# EAGLE design master (EAGLE 7.7.0)
Master Board Operation "Valhalla" CLASSIFIED: SECRET, NEED-TO-KNOW-ONLY This is the master board, it includes the master MCU and the RS-422 transceiver. One Ethernet NIC and one CanBUS NIC can be connected to this board to give a master assembly. The transceiver(r) are bus powered while the master MCU and remaining electronics are locally powered.
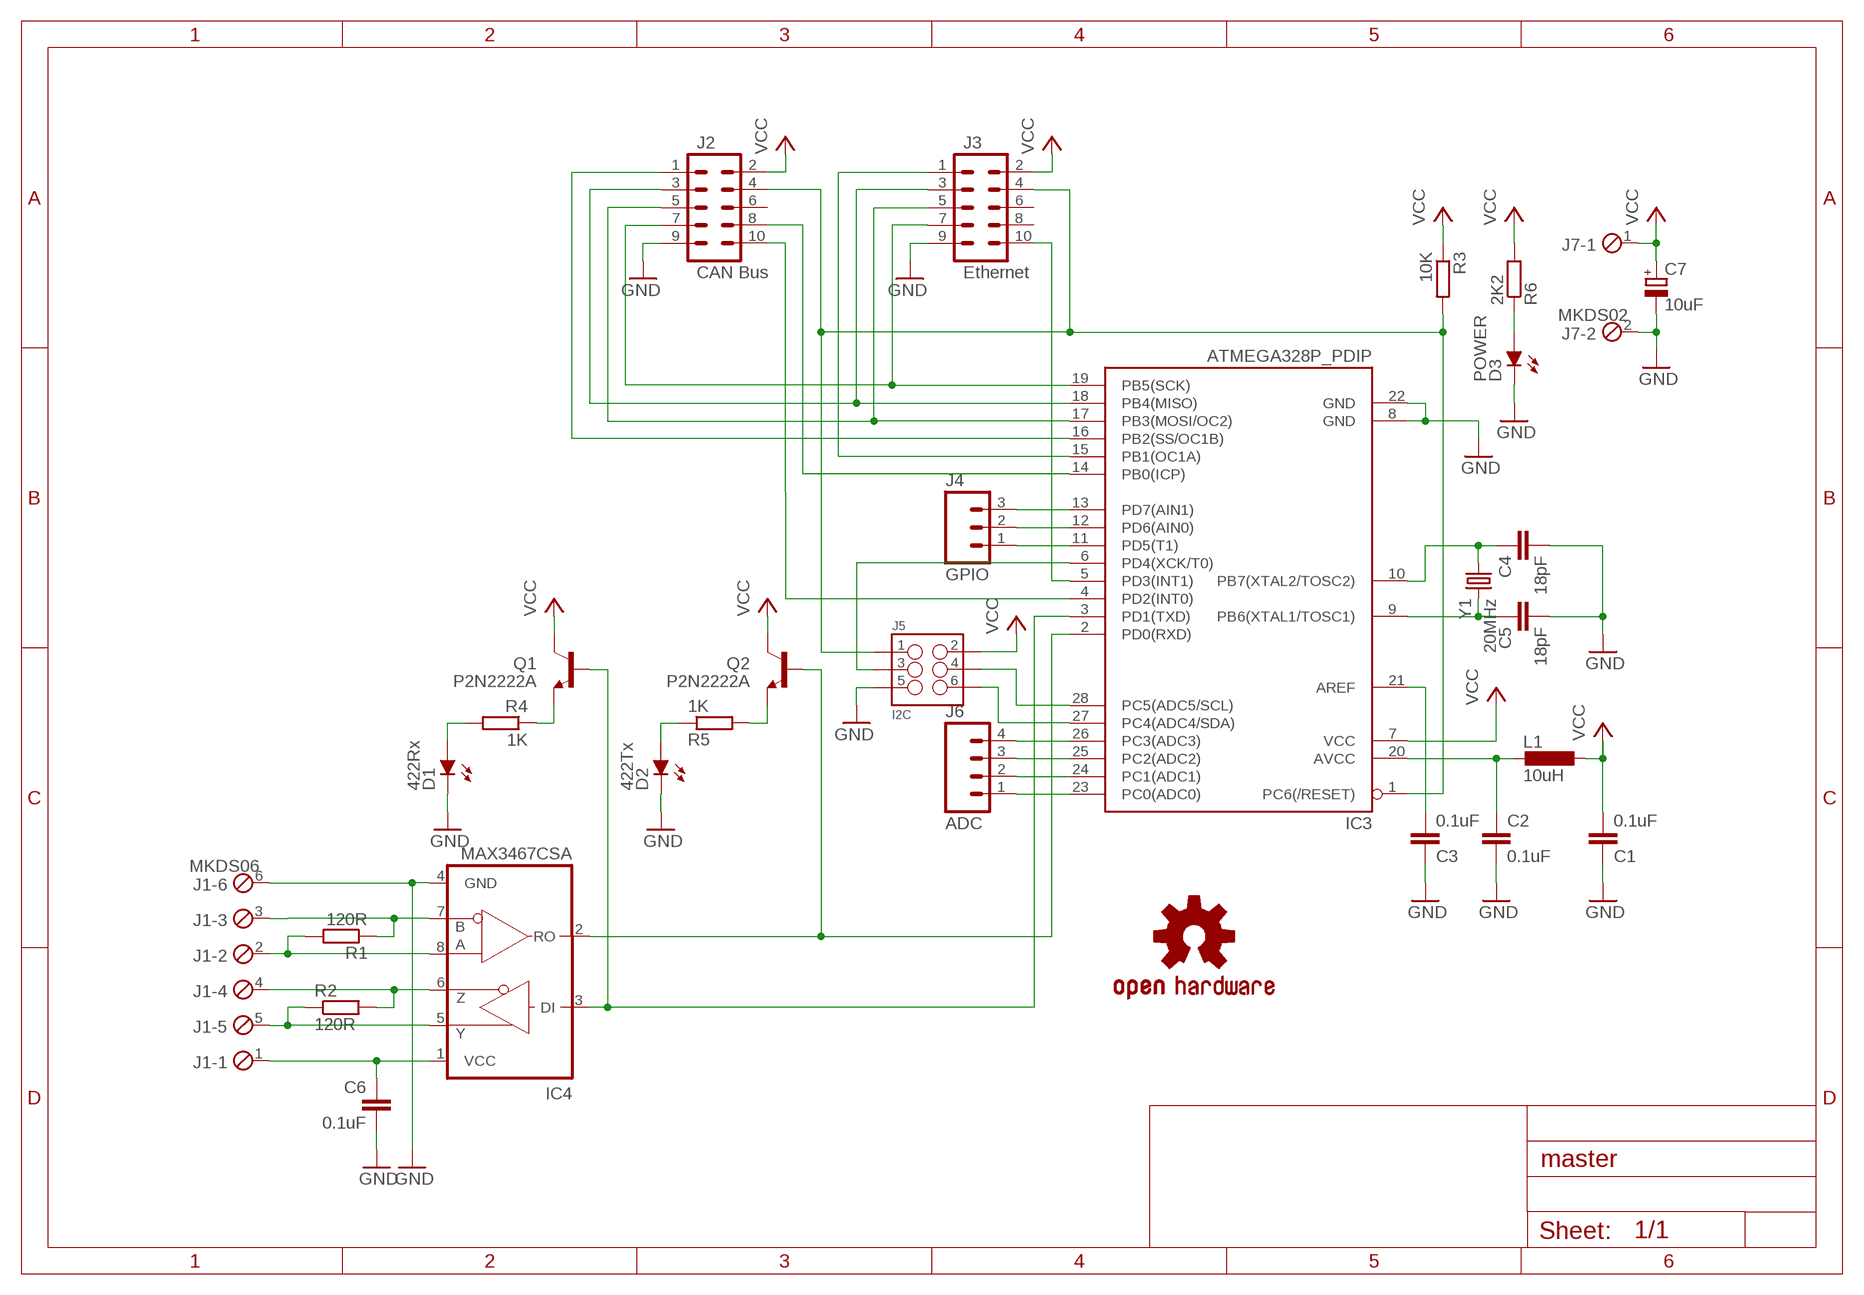
[diagram p0: schematic, sheet 1]

## Parts
C1  0.1uF  C-EU050-025X075  [C050-025X075]
C2  0.1uF  C-EU050-025X075  [C050-025X075]
C3  0.1uF  C-EU050-025X075  [C050-025X075]
C4  18pF  C-EU050-024X044  [C050-024X044]
C5  18pF  C-EU050-024X044  [C050-024X044]
C6  0.1uF  C-EU050-025X075  [C050-025X075]
C7  10uF  CPOL-EUE2.5-6  [E2,5-6]
D1  422Rx  LED3MM  [LED3MM]
D2  422Tx  LED3MM  [LED3MM]
D3  POWER  LED3MM  [LED3MM]
IC3  ATMEGA328P_PDIP  [DIL28-3]
IC4  MAX3467CSA  [DIL08]
J1  MKDS06  [MKDS06]
J2  CAN Bus  M05X2SHD  [2X5-SHROUDED]
J3  Ethernet  M05X2SHD  [2X5-SHROUDED]
J4  GPIO  M03PTH  [1X03]
J5  I2C  M03X2SHROUD  [2X3-SHROUDED]
J6  ADC  M04PTH  [1X04]
J7  MKDS02  [MKDS02]
L1  10uH  L-EU0207/5V  [0207/5V]
LOGO1  OSHW-LOGOM  [OSHW-LOGO-M]
Q1  P2N2222A  [TO92]
Q2  P2N2222A  [TO92]
R1  120R  R-EU_0207/5V  [0207/5V]
R2  120R  R-EU_0207/5V  [0207/5V]
R3  10K  R-EU_0207/5V  [0207/5V]
R4  1K  R-EU_0207/5V  [0207/5V]
R5  1K  R-EU_0207/5V  [0207/5V]
R6  2K2  R-EU_0207/5V  [0207/5V]
Y1  20MHz  CRYSTALHC49S  [HC49/S]

## Nets
422RX_N: IC4.7(B) J1.3 R1.1
422RX_P: IC4.8(A) J1.2 R1.2
422TX_N: IC4.6(Z) J1.4 R2.2
422TX_P: IC4.5(Y) J1.5 R2.1
GND: C1.1 C2.2 C3.1 C4.2 C5.2 C6.2 C7.- D1.K(C) D2.K(C) D3.K(C) IC3.8(GND) IC3.22(GND) IC4.4(GND) J1.6 J2.9 J3.9 J5.5 J7.2
N$2: C2.1 IC3.20(AVCC) L1.2
N$3: C5.1 IC3.9(PB6(XTAL1/TOSC1)) Y1.2
N$4: C3.2 IC3.21(AREF)
N$5: C6.1 IC4.1(VCC) J1.1
N$6: C4.1 IC3.10(PB7(XTAL2/TOSC2)) Y1.1
N$7: IC3.18(PB4(MISO)) J2.3 J3.3
N$8: IC3.6(PD4(XCK/T0)) J5.3
N$9: IC3.19(PB5(SCK)) J2.7 J3.7
N$10: IC3.16(PB2(SS/OC1B)) J2.1
N$11: IC3.11(PD5(T1)) J4.1
N$12: IC3.4(PD2(INT0)) J2.10
N$13: IC3.1(PC6(/RESET)) J2.4 J3.4 J5.1 R3.2
N$14: IC3.12(PD6(AIN0)) J4.2
N$15: IC3.13(PD7(AIN1)) J4.3
N$16: D2.A R5.1
N$17: D3.A R6.1
N$18: IC3.3(PD1(TXD)) IC4.3(DI) Q1.2(B)
N$19: IC3.14(PB0(ICP)) J2.8
N$20: D1.A R4.2
N$21: Q1.1(E) R4.1
N$22: Q2.1(E) R5.2
N$23: IC3.28(PC5(ADC5/SCL)) J5.4
N$24: IC3.27(PC4(ADC4/SDA)) J5.6
N$25: IC3.15(PB1(OC1A)) J3.1
N$26: IC3.5(PD3(INT1)) J3.10
N$27: IC3.17(PB3(MOSI/OC2)) J2.5 J3.5
N$28: IC3.2(PD0(RXD)) IC4.2(RO) Q2.2(B)
N$29: IC3.23(PC0(ADC0)) J6.1
N$30: IC3.24(PC1(ADC1)) J6.2
N$31: IC3.25(PC2(ADC2)) J6.3
N$32: IC3.26(PC3(ADC3)) J6.4
VCC: C1.2 C7.+ IC3.7(VCC) J2.2 J3.2 J5.2 J7.1 L1.1 Q1.3(C) Q2.3(C) R3.1 R6.2
Unconnected: J2.6 J3.6 J3.8

## Library data of the parts
C1-C6 = rcl:C-EU: CAPACITOR, European symbol
C7 = rcl:CPOL-EU: POLARIZED CAPACITOR, European symbol
D1-D3 = led:LED: LED Various Types
IC3 = SparkFun-DigitalIC-mine:ATMEGA328P_PDIP: uC used in the Arduino 32kb flash, 1k EEPROM, 2k SRAM This is the through-hole version of this chip.
IC4 = maxim:MAX3467*: +5V, Fail-Safe, 40Mbps, Profibus RS-485/RS-422 Transceivers Source: MAX3465-MAX3469.pdf
J1 = con-phoenix-508:MKDS06: Screw Connector
J2 J3 = SparkFun-Connectors-mine:M05X2: Header 5x2 Standard 10-pin dual row 0.1" header. Commonly used with AVR-ISP. Use with Spark Fun Electronics SKU: PRT-00778
J4 = SparkFun-Connectors-mine:M03: Header 3 Standard 3-pin 0.1" header. Use with straight break away headers (SKU : PRT-00116), right angle break away headers (PRT-00553), swiss pins (PRT-00743), machine pins (PRT-00117), and female headers (PRT-00115). Molex polarized connector foot print use with SKU : PRT-08232 with associated crimp pins and housings.
J5 = SparkFun-Connectors-mine:M03X2: 2x3 .1" header. Shrouded, with keying- CONN-10681 SMT- CONN-11415 Pogo pins- HW-11044; PROD_ID: CONN-10681
J6 = SparkFun-Connectors-mine:M04: Header 4 Standard 4-pin 0.1" header. Use with straight break away headers (SKU : PRT-00116), right angle break away headers (PRT-00553), swiss pins (PRT-00743), machine pins (PRT-00117), and female headers (PRT-00115). Molex polarized connector foot print use with SKU : PRT-08231 with associated crimp pins and housings. 1MM SMD Version SKU: PRT-10208; PROD_ID: CONN-09696
J7 = con-phoenix-508:MKDS02: Screw Connector
L1 = rcl:L-EU: INDUCTOR, European symbol
LOGO1 = SparkFun-Aesthetics:OSHW-LOGO: Open Source Hardware Logo This logo indicates the piece of hardware it is found on incorporates a OSHW license and/or adheres to the definition of open source hardware found here: http://freedomdefined.org/OSHW
Q1 Q2 = transistor-npn:P2N2222A: NPN Transistor
R1-R6 = rcl:R-EU_: RESISTOR, European symbol
Y1 = crystal:CRYSTAL: CRYSTAL; OC_FARNELL: 1667008; OC_NEWARK: unknown

## Board
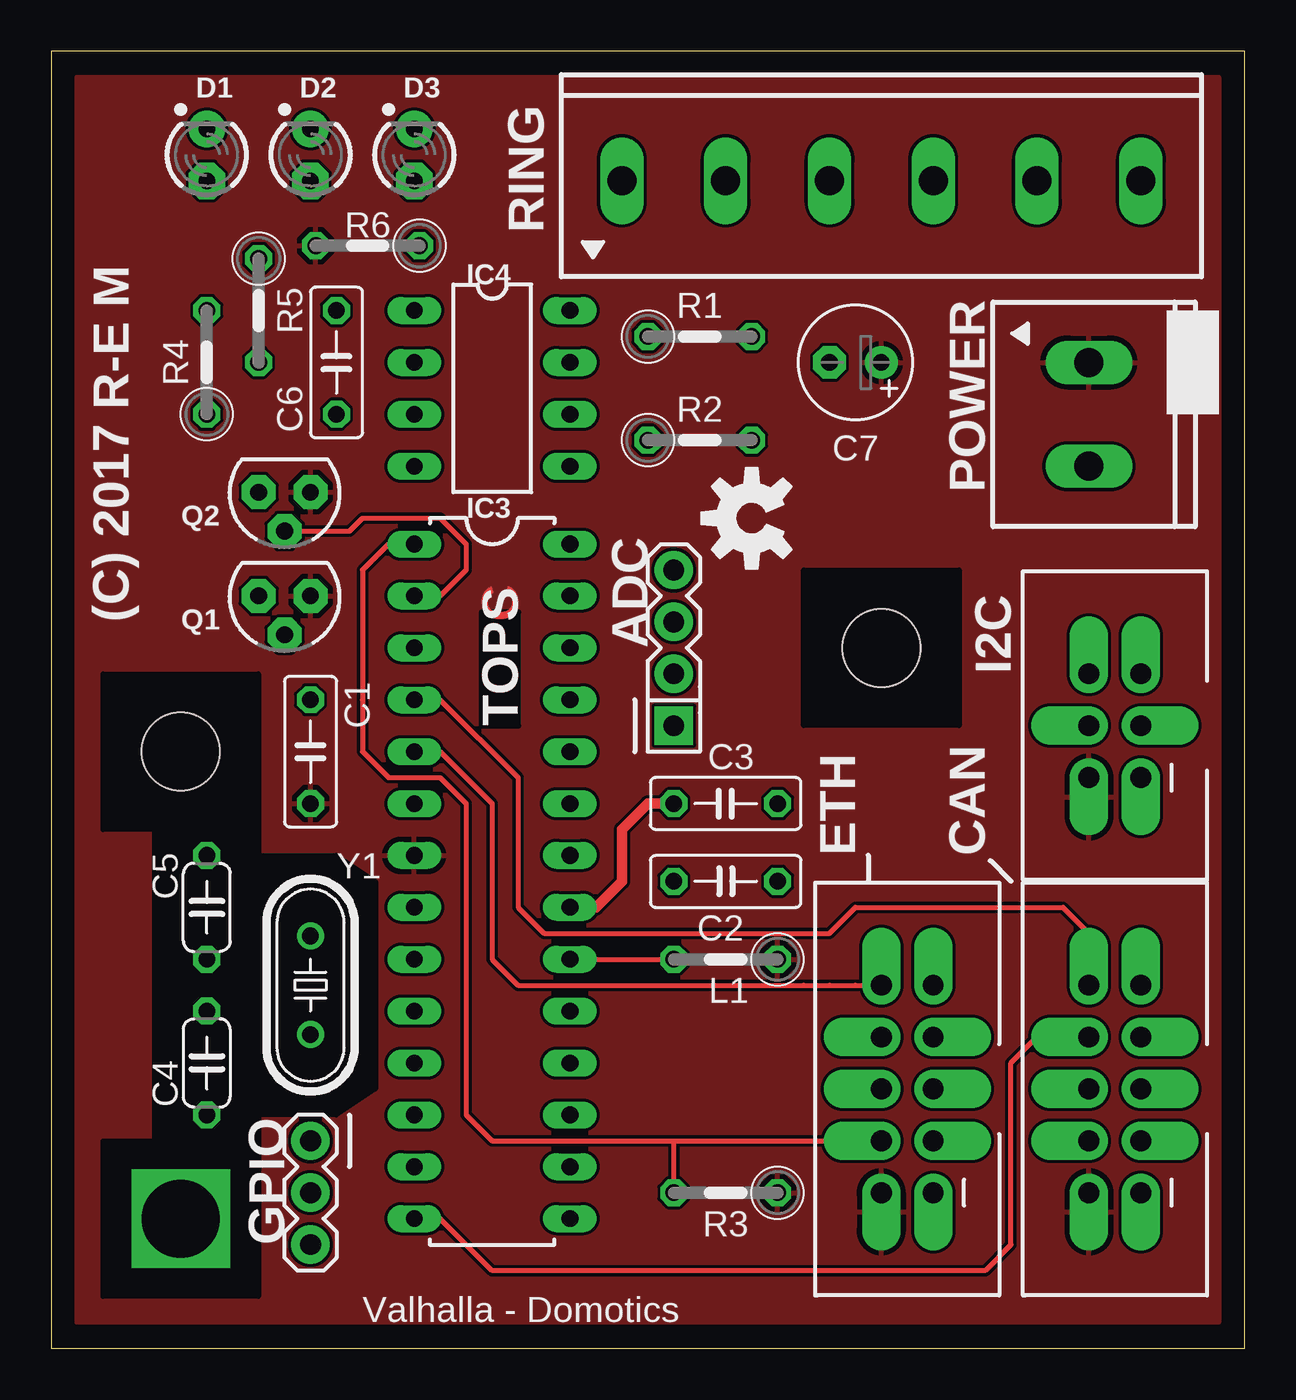
[diagram p1: board, top side]
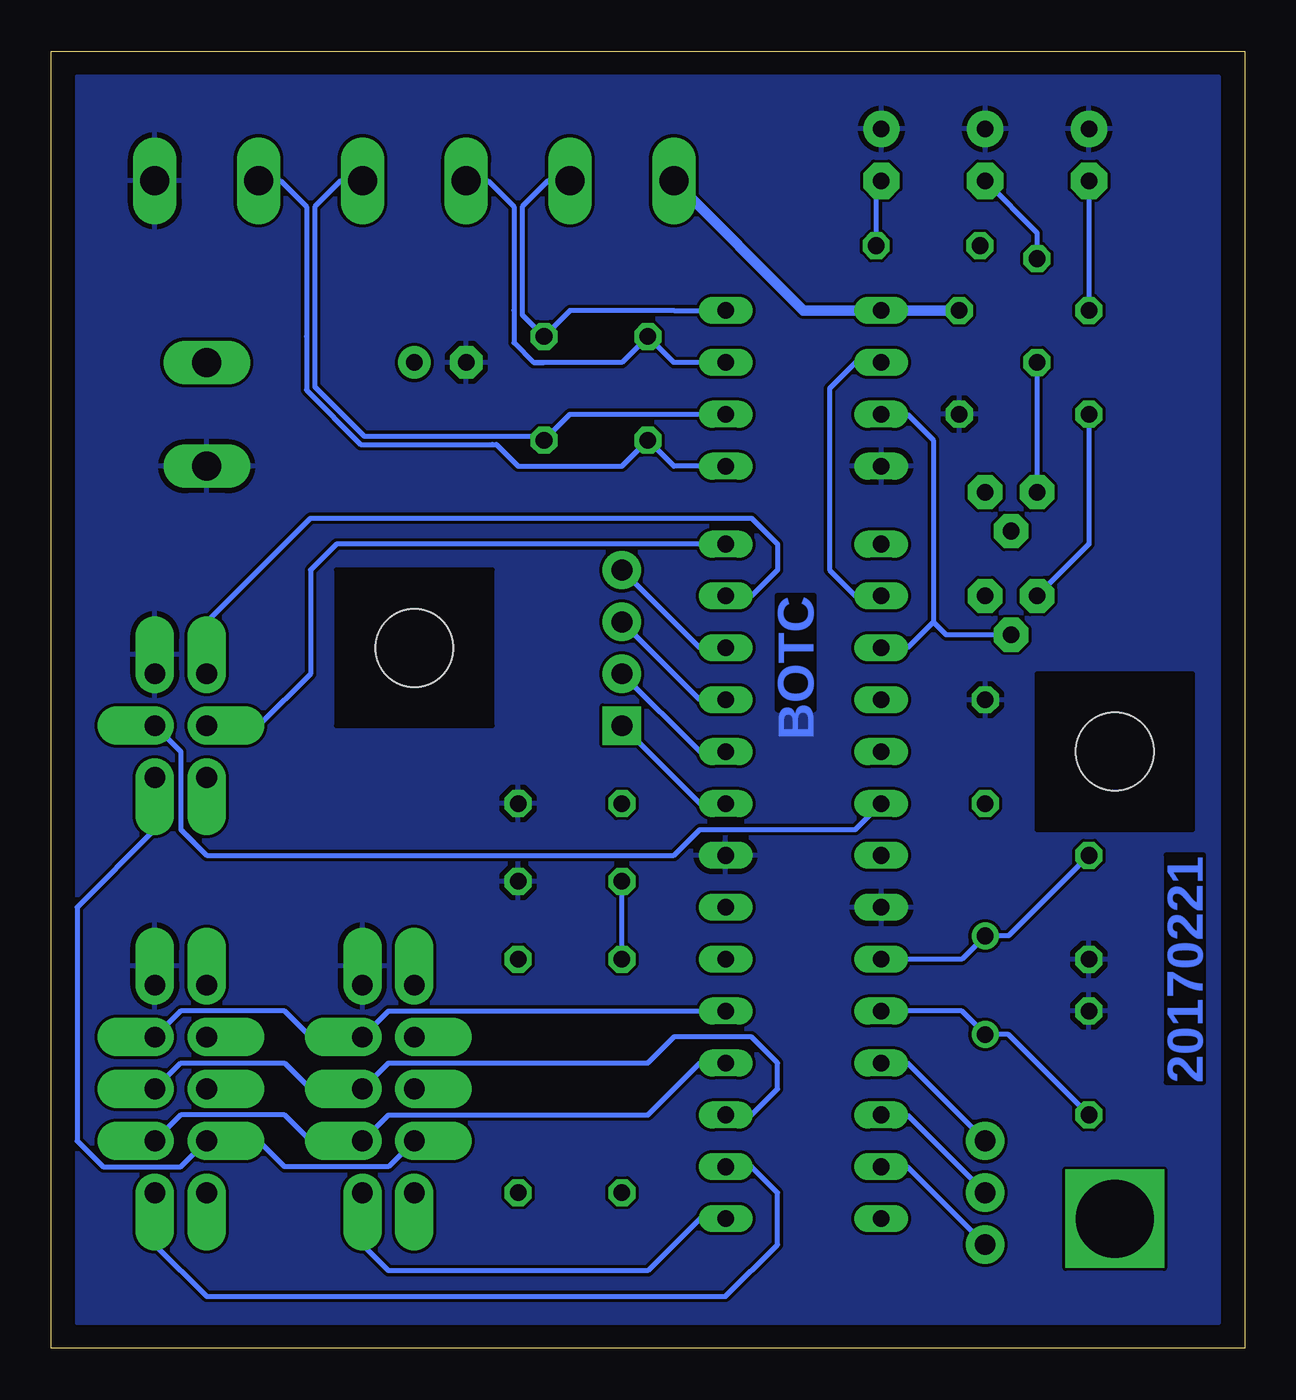
[diagram p2: board, bottom side, seen from below]

Size 58.42 x 63.5 mm. Coordinates in mm from the lower left corner, seen from the top.
Outline: 0,0 58.42,0 58.42,63.5 0,63.5 0,0
Copper layers (1*16): Top 0.035mm / dielectric 1.5mm / Bottom 0.035mm
Design rules "SeeedStudio_2layer_DRU_no_angle_20140221 *": minimum track width 6mil, minimum drill 12mil, track to track 6mil, track to pad 6mil, pad to pad 6mil, via to via 6mil, smd to smd 0mil, copper to edge 10mil, drill to drill 10mil, minimum pad ring 10mil, minimum via ring 6mil, stop-mask expansion 2mil, vias tented up to drill 100mil, thermal gap 10mil
Holes 3.81 mm at 6.35,29.21 40.64,34.29

### Footprints (pad centres in the part's own frame; a part is rotated, then mirrored left to right if it is on the bottom)
C050-025X075 = drill 0.813 octagon: 1 -2.54,0; 2 2.54,0
C050-024X044 = drill 0.813 octagon: 1 -2.54,0; 2 2.54,0
E2,5-6 = drill 0.813 pad 1.6: + -1.27,0 | drill 0.813 pad 1.6 octagon: - 1.27,0
LED3MM = drill 0.813 pad 1.778 octagon: A -1.27,0 | drill 0.813 pad 1.778: K 1.27,0
DIL28-3 = drill 0.813 long: 1 -16.51,-3.81; 2 -13.97,-3.81; 3 -11.43,-3.81; 4 -8.89,-3.81; 5 -6.35,-3.81; 6 -3.81,-3.81; 7 -1.27,-3.81; 8 1.27,-3.81; 9 3.81,-3.81; 10 6.35,-3.81; 11 8.89,-3.81; 12 11.43,-3.81; 13 13.97,-3.81; 14 16.51,-3.81; 15 16.51,3.81; 16 13.97,3.81; 17 11.43,3.81; 18 8.89,3.81; 19 6.35,3.81; 20 3.81,3.81; 21 1.27,3.81; 22 -1.27,3.81; 23 -3.81,3.81; 24 -6.35,3.81; 25 -8.89,3.81; 26 -11.43,3.81; 27 -13.97,3.81; 28 -16.51,3.81
DIL08 = drill 0.813 long: 1 -3.81,-3.81; 2 -1.27,-3.81; 3 1.27,-3.81; 4 3.81,-3.81; 5 3.81,3.81; 6 1.27,3.81; 7 -1.27,3.81; 8 -3.81,3.81
MKDS06 = drill 1.422 long: 1 -12.7,0; 2 -7.62,0; 3 -2.54,0; 4 2.54,0; 5 7.62,0; 6 12.7,0
2X5-SHROUDED = drill 1.016 pad 1.88 offset: 1 -1.27,5.08; 2 1.27,5.08; 3 -1.27,2.54; 4 1.27,2.54; 5 -1.27,0; 6 1.27,0; 7 -1.27,-2.54; 8 1.27,-2.54; 9 -1.27,-5.08; 10 1.27,-5.08
1X03 = drill 1.016 pad 1.88: 1 0,0; 2 2.54,0; 3 5.08,0
2X3-SHROUDED = drill 1.016 pad 1.88 offset: 1 -1.27,2.54; 2 1.27,2.54; 3 -1.27,0; 4 1.27,0; 5 -1.27,-2.54; 6 1.27,-2.54
1X04 = drill 1.016 pad 1.88 square: 1 0,0 | drill 1.016 pad 1.88: 2 2.54,0; 3 5.08,0; 4 7.62,0
MKDS02 = drill 1.422 long: 1 -2.54,0; 2 2.54,0
0207/5V = drill 0.813 octagon: 1 -2.54,0; 2 2.54,0
TO92 = drill 0.813 pad 1.676 octagon: 1 1.27,0; 2 0,1.905; 3 -1.27,0
HC49/S = drill 0.813: 1 -2.413,0; 2 2.413,0

### Placement (x,y rotation side)
C1  12.7,29.21 270 top
C2  33.02,22.86 0 top
C3  33.02,26.67 180 top
C4  7.62,13.97 90 top
C5  7.62,21.59 270 top
C6  13.97,48.26 270 top
C7  39.37,48.26 180 top
D1  7.62,58.42 90 top
D2  12.7,58.42 90 top
D3  17.78,58.42 90 top
IC3  21.59,22.86 270 top
IC4  21.59,46.99 270 top
J1  40.64,57.15 0 top
J2  52.07,12.7 180 top
J3  41.91,12.7 180 top
J4  12.7,10.16 270 top
J5  52.07,30.48 180 top
J6  30.48,30.48 90 top
J7  50.8,45.72 270 top
L1  33.02,19.05 180 top
LOGO1  34.29,40.64 90 top
Q1  11.43,36.83 180 top
Q2  11.43,41.91 180 top
R1  31.75,49.53 0 top
R2  31.75,44.45 0 top
R3  33.02,7.62 180 top
R4  7.62,48.26 90 top
R5  10.16,50.8 270 top
R6  15.49,53.98 180 top
Y1  12.7,17.78 90 top

### Tracks (layer width: path | path; a pad name or v marks a point on that pad's centre or on a via)
422RX_N
  Bottom 0.254: IC4.7 27.94,48.26 R1.1 30.48,48.26 34.29,48.26 | 34.29,48.26 34.8,48.26 | 34.8,48.26 34.29,48.26 | J1.3 37.03,57.15 35.76,55.88 35.76,50.8 35.76,49.23 34.8,48.26
422RX_P
  Bottom 0.254: IC4.8 27.94,50.8 33.02,50.8 R1.2 35.36,50.6 35.36,50.8 35.36,55.88 34.09,57.15 J1.2
422TX_N
  Bottom 0.254: IC4.6 27.94,45.72 33.02,45.72 R2.2 34.49,44.65 36.83,44.65 43.1,44.65 45.52,47.07 45.52,49.53 45.52,55.88 44.25,57.15 J1.4
422TX_P
  Bottom 0.254: IC4.5 27.94,43.18 R2.1 30.48,43.18 35.56,43.18 36.63,44.25 36.83,44.25 43.26,44.25 45.92,46.91 45.92,49.53 45.92,55.88 47.19,57.15 J1.5
GND
  pour Bottom: 1.27,62.23 57.15,62.23 57.15,1.27 1.27,1.27
N$1
  cutout Top: 5.08,25.4 10.16,25.4 10.16,24.13 13.97,24.13 15.88,22.86 15.88,12.7 13.97,11.43 10.16,11.43 10.16,10.16 5.08,10.16
N$2
  Top 0.254: IC3.20 L1.2
  Bottom 0.254: L1.2 C2.1
N$3
  Bottom 0.254: C5.1 11.56,20.19 Y1.2 13.84,19.05 IC3.9
N$4
  Top 0.508: IC3.21 26.67,21.59 27.94,22.86 27.94,25.4 29.21,26.67 C3.2
N$5
  Bottom 0.508: C6.1 IC4.1 21.59,50.8 J1.1
N$6
  Bottom 0.254: C4.1 11.56,15.37 Y1.1 13.84,16.51 IC3.10
N$7
  Bottom 0.254: IC3.18 26.67,13.97 29.21,11.43 41.91,11.43 J3.3 45.72,10.16 46.99,11.43 52.07,11.43 J2.3
N$8
  Bottom 0.254: J5.3 52.07,29.21 52.07,25.4 50.8,24.13 27.94,24.13 26.67,25.4 19.05,25.4 IC3.6
N$9
  Bottom 0.254: J2.7 52.07,16.51 46.99,16.51 45.72,15.24 J3.7 41.91,16.51 IC3.19
N$10
  Bottom 0.254: IC3.16 24.13,8.89 22.86,7.62 22.86,5.08 25.4,2.54 50.8,2.54 53.34,5.08 J2.1
N$11
  Bottom 0.254: J4.1 16.51,13.97 IC3.11
N$12
  Top 0.254: IC3.4 19.05,31.75 22.86,27.94 22.86,21.59 24.13,20.32 38.1,20.32 39.37,21.59 49.53,21.59 50.8,20.32 J2.10
N$13
  Top 0.254: 30.48,10.16 21.59,10.16 20.32,11.43 20.32,26.67 19.05,27.94 16.51,27.94 15.24,29.21 15.24,31.75 15.24,38.1 16.51,39.37 IC3.1 | 30.48,10.16 35.56,10.16 36.83,10.16 38.1,10.16 J3.4 | R3.2 30.48,10.16
  Bottom 0.254: J5.1 53.34,25.4 57.15,21.59 57.15,10.16 55.88,8.89 52.07,8.89 J2.4 48.26,10.16 46.99,8.89 41.91,8.89 J3.4
N$14
  Bottom 0.254: IC3.12 16.51,11.43 J4.2
N$15
  Bottom 0.254: IC3.13 16.51,8.89 J4.3
N$16
  Bottom 0.254: D2.A 10.16,54.61 R5.1
N$17
  Bottom 0.254: R6.1 18.03,56.9 D3.A
N$18
  Bottom 0.254: IC4.3 16.51,45.72 15.24,44.45 15.24,35.56 | 15.24,35.56 16.51,34.29 IC3.3 | Q1.2 14.61,34.92 15.24,35.56
N$19
  Top 0.254: IC3.14 19.05,6.35 21.59,3.81 45.72,3.81 46.99,5.08 46.99,13.97 48.26,15.24 J2.8
N$20
  Bottom 0.254: D1.A R4.2
N$21
  Bottom 0.254: R4.1 7.62,39.37 Q1.1
N$22
  Bottom 0.254: R5.2 Q2.1
N$23
  Bottom 0.254: IC3.28 44.45,39.37 45.72,38.1 45.72,33.02 48.26,30.48 J5.4
N$24
  Bottom 0.254: J5.6 50.8,35.56 45.72,40.64 24.13,40.64 22.86,39.37 22.86,38.1 24.13,36.83 IC3.27
N$25
  Bottom 0.254: IC3.15 26.67,6.35 29.21,3.81 41.91,3.81 43.18,5.08 J3.1
N$26
  Top 0.254: IC3.5 19.05,29.21 21.59,26.67 21.59,19.05 22.86,17.78 36.83,17.78 38.1,17.78 39.37,17.78 J3.10
N$27
  Bottom 0.254: J2.5 52.07,13.97 46.99,13.97 45.72,12.7 J3.5 41.91,13.97 29.21,13.97 27.94,15.24 24.13,15.24 22.86,13.97 22.86,12.7 24.13,11.43 IC3.17
N$28
  Top 0.254: Q2.2 14.61,40.01 15.24,40.64 19.05,40.64 20.32,39.37 20.32,38.1 19.05,36.83 IC3.2
  Bottom 0.254: IC4.2 19.05,48.26 20.32,46.99 20.32,38.1 19.05,36.83 IC3.2
N$29
  Bottom 0.254: IC3.23 26.67,26.67 J6.1
N$30
  Bottom 0.254: IC3.24 26.67,29.21 J6.2
N$31
  Bottom 0.254: IC3.25 26.67,31.75 J6.3
N$32
  Bottom 0.254: IC3.26 26.67,34.29 J6.4
N$33  (via drill 3.81)
  other vias: 6.35,6.35
N$34
  cutout Bottom: 2.54,33.02 10.16,33.02 10.16,25.4 2.54,25.4
N$35
  cutout Bottom: 36.83,38.1 44.45,38.1 44.45,30.48 36.83,30.48
N$39
  cutout Top: 2.54,10.16 10.16,10.16 10.16,2.54 2.54,2.54
N$40
  cutout Top: 2.54,33.02 10.16,33.02 10.16,25.4 2.54,25.4
N$41
  cutout Top: 36.83,38.1 44.45,38.1 44.45,30.48 36.83,30.48
VCC
  pour Top: 1.27,62.23 57.15,62.23 57.15,1.27 1.27,1.27

### Text on the board
Top: TOPC
Bottom: BOTC | 20170221
tPlace: RING | POWER | (C) 2017 R-E M | ADC | I2C | TOPS | ETH | CAN | GPIO | Valhalla - Domotics
tNames: IC3